# Altium schematic sheet active_filter_2500Hz.SchDoc
size A
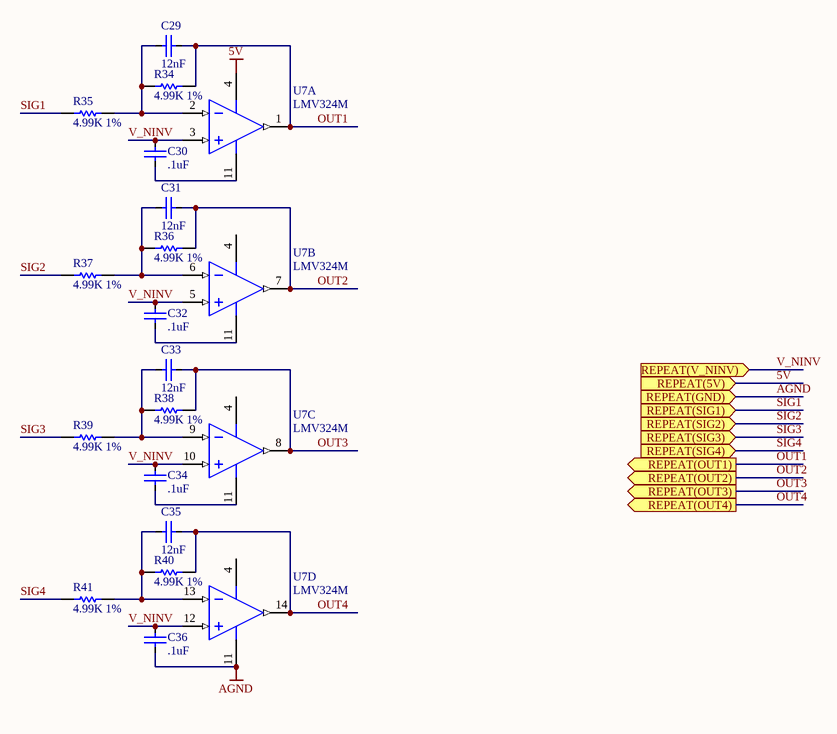
[diagram p0: active_filter_2500Hz.SchDoc]

## Parts
C29  value 12nF  [0603 (1608)]  (hidden comment: Capacitor)
C30  value .1uF  [0603 (1608)]  (hidden comment: Capacitor)
C31  value 12nF  [0603 (1608)]  (hidden comment: Capacitor)
C32  value .1uF  [0603 (1608)]  (hidden comment: Capacitor)
C33  value 12nF  [0603 (1608)]  (hidden comment: Capacitor)
C34  value .1uF  [0603 (1608)]  (hidden comment: Capacitor)
C35  value 12nF  [0603 (1608)]  (hidden comment: Capacitor)
C36  value .1uF  [0603 (1608)]  (hidden comment: Capacitor)
R34  value 4.99K 1%  [0603 (1608)]  (hidden comment: Res1)
R35  value 4.99K 1%  [0603 (1608)]  (hidden comment: Res1)
R36  value 4.99K 1%  [0603 (1608)]  (hidden comment: Res1)
R37  value 4.99K 1%  [0603 (1608)]  (hidden comment: Res1)
R38  value 4.99K 1%  [0603 (1608)]  (hidden comment: Res1)
R39  value 4.99K 1%  [0603 (1608)]  (hidden comment: Res1)
R40  value 4.99K 1%  [0603 (1608)]  (hidden comment: Res1)
R41  value 4.99K 1%  [0603 (1608)]  (hidden comment: Res1)
U7  LMV324M  [M14A_N]  (parts A,B,C,D of 4)

## Ports
REPEAT(5V) (in), REPEAT(GND) (in), REPEAT(OUT1) (out), REPEAT(OUT2) (out), REPEAT(OUT3) (out), REPEAT(OUT4) (out), REPEAT(SIG1) (in), REPEAT(SIG2) (in), REPEAT(SIG3) (in), REPEAT(SIG4) (in), REPEAT(V_NINV) (in)

## Nets
5V: U7.4(V+) ; port REPEAT(5V)
AGND: C36.2 U7.11(V-) ; port REPEAT(GND)
OUT1: C29.2 R34.1 U7.1(OUTA) ; port REPEAT(OUT1)
OUT2: C31.2 R36.1 U7.7(OUTB) ; port REPEAT(OUT2)
OUT3: C33.2 R38.1 U7.8(OUTC) ; port REPEAT(OUT3)
OUT4: C35.2 R40.1 U7.14(OUTD) ; port REPEAT(OUT4)
SIG1: R35.2 ; port REPEAT(SIG1)
SIG2: R37.2 ; port REPEAT(SIG2)
SIG3: R39.2 ; port REPEAT(SIG3)
SIG4: R41.2 ; port REPEAT(SIG4)
V_NINV: C30.1 C32.1 C34.1 C36.1 U7.3(INA+) U7.5(INB+) U7.10(INC+) U7.12(IND+) ; port REPEAT(V_NINV)
NetC29_1: C29.1 R34.2 R35.1 U7.2(INA-)
NetC30_2: C30.2 U7.11(V-)
NetC31_1: C31.1 R36.2 R37.1 U7.6(INB-)
NetC32_2: C32.2 U7.11(V-)
NetC33_1: C33.1 R38.2 R39.1 U7.9(INC-)
NetC34_2: C34.2 U7.11(V-)
NetC35_1: C35.1 R40.2 R41.1 U7.13(IND-)

## Library data of the parts
C29 C31 C33 C35 = Capacitor: Manufacturer: Murata; Part No.: 490-1513-1-ND; Vendor: Digikey; Price Est.: $0.062
C30 C32 C34 C36 = Capacitor: Manufacturer: Murata; Part No.: 490-1524-1-ND; Vendor: Digikey; Price Est.: $0.019
R34-R41 = Res1: Resistor; Part No.: P4.99KHCT-ND; Vendor: Digikey; Price Est.: $0.04
U7 = LMV324M: General Purpose, Low Voltage, Rail-to-Rail Output Operational Amplifiers; Manufacturer: National Semiconductor; PackageTopMarking: NSUZXYTT*LMV324M; PowerWise: N; Published: 4-Dec-2008; LatestRevisionDate: 13-Jan-2009; LatestRevisionNote: Sim Model Added.; DatasheetVersion: Oct-2007; PackageVersion: revJ, Jan-1996; PackageReference: M14A; Publisher: Altium Limited; PackageDescription: Molded Package S.O., .150in Wide, 14 Lead; CompType: Amplifiers; PartNumber: LMV324M; RoHS: O; PinCount: 14; DigiKeyPartNumber: LMV324MXCT-ND; Code_JEDEC: MS-012AB; Code_IPC: SOIC127P600-14; ComponentLink1Description: LMV324 Datasheet; ComponentLink1URL: http://www.national.com/ds/LM/LMV324.pdf; ComponentLink2Description: LMV324 Web Page; ComponentLink2URL: http://www.national.com/pf/LM/LMV324.html; ComponentLink3Description: M14A Package Page; ComponentLink3URL: http://www.national.com/packaging/folders/m14a.html